# Altium schematic sheet PERSEUS_Schematic1.SchDoc
size A4; SheetNumber: 1; SheetTotal: 4
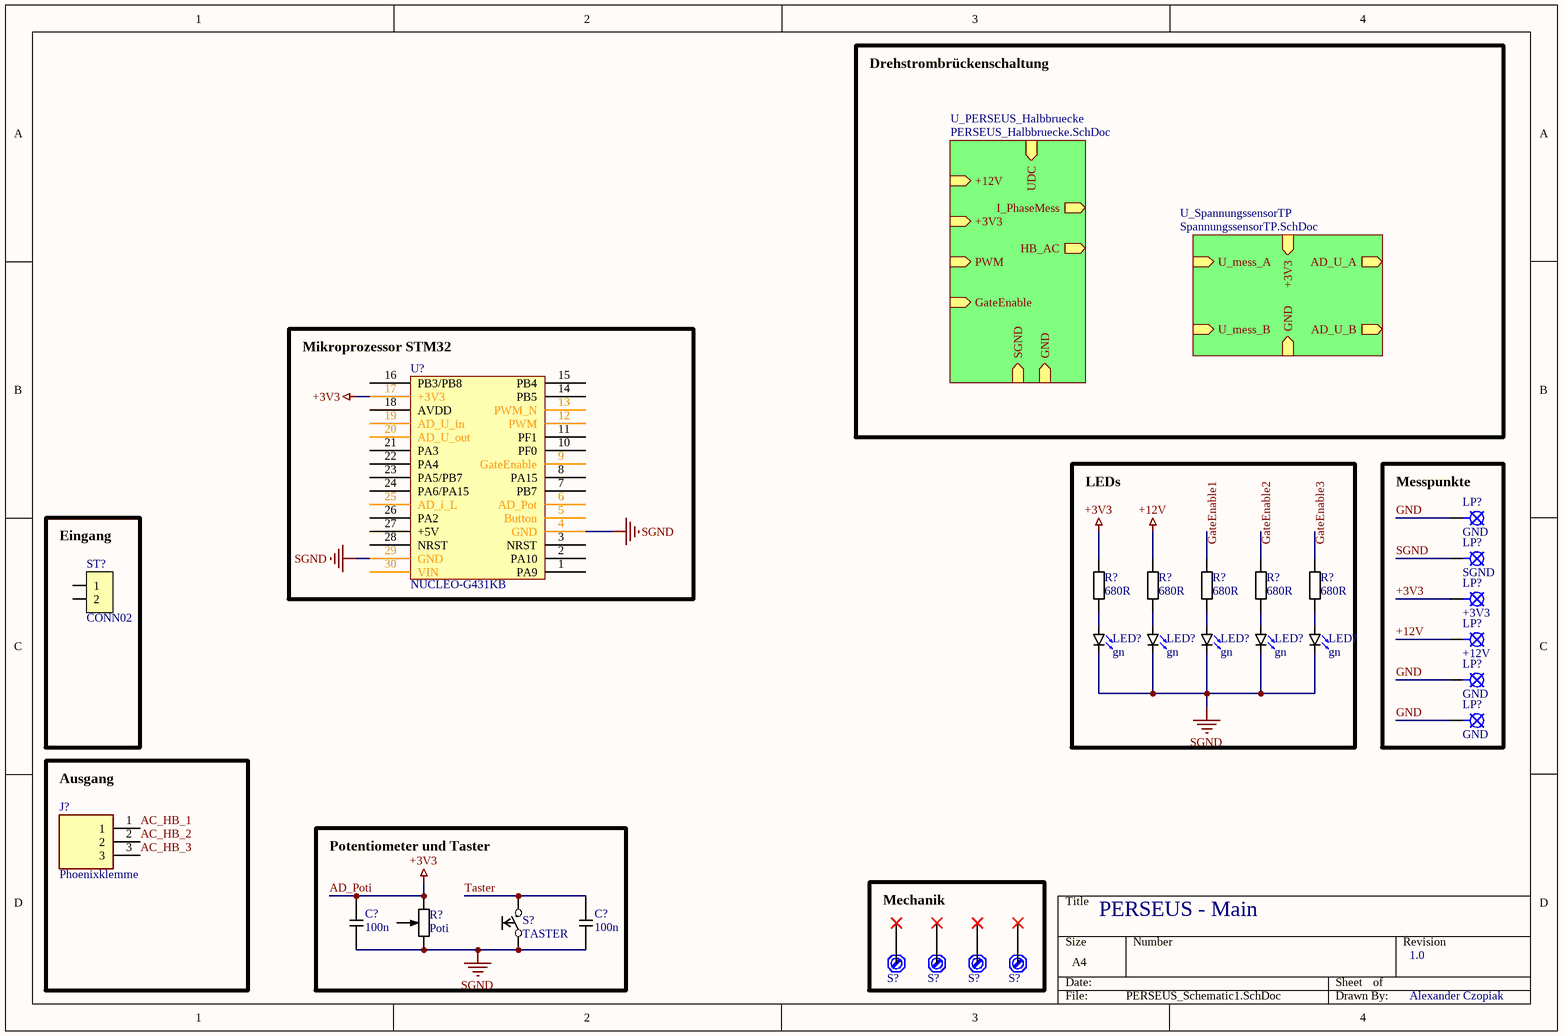
[diagram p0: PERSEUS_Schematic1.SchDoc]

## Parts
(Parts that share a designator on the sheet are numbered #1, #2 ... from top to bottom, then left to right.)
C?#1  100n  [1206_C]
C?#2  100n  [1206_C]
J?  Phoenixklemme  [1717033]
LED?#1  gn  [0805_DI_gr]
LED?#2  gn  [0805_DI_gr]
LED?#3  gn  [0805_DI_gr]
LED?#4  gn  [0805_DI_gr]
LED?#5  gn  [0805_DI_gr]
LP?#1  GND  [LP1]
LP?#2  SGND  [LP1]
LP?#3  +3V3  [LP1]
LP?#4  +12V  [LP1]
LP?#5  GND  [LP1]
LP?#6  GND  [LP1]
R?#1  680R  [1206_R]
R?#2  680R  [1206_R]
R?#3  680R  [1206_R]
R?#4  680R  [1206_R]
R?#5  680R  [1206_R]
R?#6  Poti  [POT_T607_3D]
S?#1  TASTER  [TASTERSMD_3D]
S?#2  (no value)  [M3]
S?#3  (no value)  [M3]
S?#4  (no value)  [M3]
S?#5  (no value)  [M3]
ST?  CONN02  [MKDS 1,5/ 2]
U?  NUCLEO-G431KB  [NUCLEO-G431KB]

## Blocks framed on the sheet
Mikroprozessor STM32: U?
Eingang: ST?
LEDs: LED?#1-LED?#5 R?#1-R?#5
Messpunkte: LP?#1-LP?#6
Ausgang: J?
Potentiometer und Taster: C?#1 C?#2 R?#6 S?#1
Mechanik: S?#2-S?#5

## Sub-sheets
U_PERSEUS_Halbbruecke = PERSEUS_Halbbruecke.SchDoc: UDC (in), SGND (in), PWM (in), HB_AC (out), GateEnable (in), +12V (in), +3V3 (in), GND (in), I_PhaseMess (out)
U_SpannungssensorTP = SpannungssensorTP.SchDoc: AD_U_B (out), U_mess_B (in), GND (in), AD_U_A (out), U_mess_A (in), +3V3 (in)

## Nets
+3V3: C?#1.2 LP?#3.1 R?#1.2 R?#6.2 U?.17(+3V3)  [also labelled AD_Poti]
+12V: LP?#4.1 R?#2.2
SGND: C?#1.1 C?#2.1 LED?#1.2(K) LED?#2.2(K) LED?#3.2(K) LED?#4.2(K) LED?#5.2(K) LP?#2.1 R?#6.1 S?#1.2 U?.4(GND) U?.29(GND)
AC_HB_1: J?.1
AC_HB_2: J?.2
AC_HB_3: J?.3
GND: LP?#1.1 LP?#5.1 LP?#6.1
Taster: C?#2.2 S?#1.1
NetLED?#1_1: LED?#1.1(A) R?#1.1
NetLED?#2_1: LED?#2.1(A) R?#2.1
NetLED?#3_1: LED?#3.1(A) R?#3.1
NetLED?#4_1: LED?#4.1(A) R?#4.1
NetLED?#5_1: LED?#5.1(A) R?#5.1

Not connected (* = marked no-connect by the designer): R?#3 2; R?#4 2; R?#5 2; R?#6 W(Abgriff); S?#2 1*; S?#3 1*; S?#4 1*; S?#5 1*; ST? 1 2; U? 1(PA9) 2(PA10) 3(NRST) 5(Button) 6(AD_Pot) 7(PB7) 8(PA15) 9(GateEnable) 10(PF0) 11(PF1) 12(PWM) 13(PWM_N) 14(PB5) 15(PB4) 16(PB3/PB8) 18(AVDD) 19(AD_U_in) 20(AD_U_out) 21(PA3) 22(PA4) 23(PA5/PB7) 24(PA6/PA15) 25(AD_i_L) 26(PA2) 27(+5V) 28(NRST) 30(VIN)

## Notes on the sheet
- Drehstrombrückenschaltung
- PERSEUS - Main
- 1.0
- Alexander Czopiak
- Labels drawn without touching a wire or pin: GateEnable1, GateEnable2, GateEnable3

## Library data of the parts
C?#1 C?#2 = CAP: Kondensator (ohne Polarität)
J? = 1717033: Fixed Terminal Blocks 3P 7.5mm; Manufacturer_Name: Phoenix Contact; Geometry.Height: 13.9mm; Manufacturer_Part_Number: 1717033; Mouser Part Number: 651-1717033; Mouser Price/Stock: https://www.mouser.co.uk/ProductDetail/Phoenix-Contact/1717033?qs=aYsvlkyO7qPHPfcN%252B81Plg%3D%3D; Arrow Part Number: 1717033; Arrow Price/Stock: https://www.arrow.com/en/products/1717033/phoenix-contact?utm_currency=USD&region=nac; Datasheet Link: https://media.digikey.com/pdf/Data%20Sheets/Phoenix%20Contact%20PDFs/1717033.pdf
LED?#1-LED?#5 = LED SMD 0805: LED SMD 0805 (gruen)
LP?#1-LP?#6 = LP
R?#1-R?#5 = WIDERSTAND
R?#6 = POT: Widerstand
S?#1 = TASTER-SMD
S?#2-S?#5 = SCHRAUBE/BOLZEN
ST? = CONN02: Phönix-Klemme